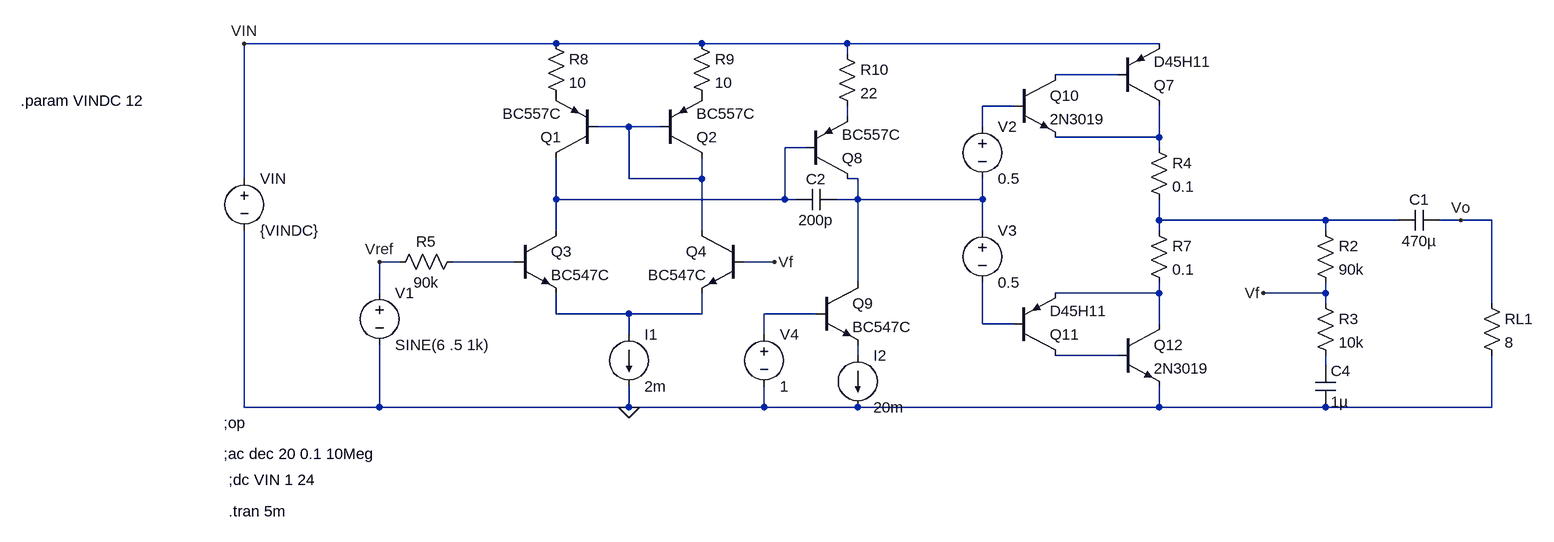
[diagram p0: schematic RegLin_v5_to_Amp_5.asc]
RegLin_v5_to_Amp_5.asc, the LTspice schematic file:
Version 4
SHEET 1 2168 1176
WIRE 96 -32 -384 -32
WIRE 320 -32 96 -32
WIRE 544 -32 320 -32
WIRE 1024 -32 544 -32
WIRE 544 -16 544 -32
WIRE 960 16 864 16
WIRE 800 64 752 64
WIRE 544 80 544 64
WIRE 208 96 160 96
WIRE 256 96 208 96
WIRE 752 96 752 64
WIRE 1024 112 1024 64
WIRE 1024 112 864 112
WIRE 480 128 448 128
WIRE 1024 128 1024 112
WIRE -384 176 -384 -32
WIRE 208 176 208 96
WIRE 320 176 320 144
WIRE 320 176 208 176
WIRE 560 176 544 176
WIRE 96 208 96 144
WIRE 448 208 448 128
WIRE 448 208 96 208
WIRE 464 208 448 208
WIRE 560 208 560 176
WIRE 560 208 528 208
WIRE 752 208 752 176
WIRE 752 208 560 208
WIRE 1024 240 1024 208
WIRE 1280 240 1024 240
WIRE 1392 240 1280 240
WIRE 1488 240 1456 240
WIRE 1536 240 1488 240
WIRE 96 256 96 208
WIRE 320 256 320 176
WIRE 752 256 752 208
WIRE 1024 256 1024 240
WIRE 1280 256 1280 240
WIRE -144 304 -176 304
WIRE 32 304 -64 304
WIRE 432 304 384 304
WIRE 560 336 560 208
WIRE -176 352 -176 304
WIRE 1024 352 1024 336
WIRE 1024 352 864 352
WIRE 1280 352 1280 336
WIRE 1280 352 1184 352
WIRE 1280 368 1280 352
WIRE 1536 368 1536 240
WIRE 96 384 96 352
WIRE 208 384 96 384
WIRE 320 384 320 352
WIRE 320 384 208 384
WIRE 496 384 416 384
WIRE 752 400 752 336
WIRE 800 400 752 400
WIRE 1024 400 1024 352
WIRE 208 416 208 384
WIRE 416 416 416 384
WIRE 560 448 560 432
WIRE 960 448 864 448
WIRE 1280 464 1280 448
WIRE -384 528 -384 256
WIRE -176 528 -176 432
WIRE -176 528 -384 528
WIRE 208 528 208 496
WIRE 208 528 -176 528
WIRE 416 528 416 496
WIRE 416 528 208 528
WIRE 560 528 416 528
WIRE 1024 528 1024 496
WIRE 1024 528 560 528
WIRE 1280 528 1024 528
WIRE 1536 528 1536 448
WIRE 1536 528 1280 528
FLAG 208 528 0
FLAG -176 304 Vref
FLAG -384 -32 VIN
FLAG 1488 240 Vo
FLAG 1184 352 Vf
FLAG 432 304 Vf
DATAFLAG 1184 240 ""
DATAFLAG 1232 352 ""
SYMBOL pnp 160 144 R180
SYMATTR InstName Q1
SYMATTR Value BC557C
SYMBOL pnp 256 144 M180
SYMATTR InstName Q2
SYMATTR Value BC557C
SYMBOL npn 32 256 R0
SYMATTR InstName Q3
SYMATTR Value BC547C
SYMBOL npn 384 256 M0
SYMATTR InstName Q4
SYMATTR Value BC547C
SYMBOL voltage -384 160 R0
WINDOW 123 24 124 Left 2
WINDOW 39 0 0 Left 0
SYMATTR InstName VIN
SYMATTR Value {VINDC}
SYMBOL res 80 -48 R0
SYMATTR InstName R8
SYMATTR Value 10
SYMBOL res 304 -48 R0
SYMATTR InstName R9
SYMATTR Value 10
SYMBOL pnp 480 176 M180
SYMATTR InstName Q8
SYMATTR Value BC557C
SYMBOL res 528 -32 R0
SYMATTR InstName R10
SYMATTR Value 22
SYMBOL cap 528 192 R90
WINDOW 0 0 32 VBottom 2
WINDOW 3 32 32 VTop 2
SYMATTR InstName C2
SYMATTR Value 200p
SYMATTR SpiceLine Rser=1k
SYMBOL npn 496 336 R0
SYMATTR InstName Q9
SYMATTR Value BC547C
SYMBOL pnp 960 64 M180
SYMATTR InstName Q7
SYMATTR Value D45H11
SYMBOL npn 800 16 R0
SYMATTR InstName Q10
SYMATTR Value 2N3019
SYMBOL res 1264 240 R0
SYMATTR InstName R2
SYMATTR Value 90k
SYMBOL res 1264 352 R0
SYMATTR InstName R3
SYMATTR Value 10k
SYMBOL res 1520 352 R0
SYMATTR InstName RL1
SYMATTR Value 8
SYMBOL cap 1456 224 R90
WINDOW 0 0 32 VBottom 2
WINDOW 3 32 32 VTop 2
SYMATTR InstName C1
SYMATTR Value 470µ
SYMBOL pnp 800 448 M180
SYMATTR InstName Q11
SYMATTR Value D45H11
SYMBOL npn 960 400 R0
SYMATTR InstName Q12
SYMATTR Value 2N3019
SYMBOL res 1008 112 R0
SYMATTR InstName R4
SYMATTR Value 0.1
SYMBOL res 1008 240 R0
SYMATTR InstName R7
SYMATTR Value 0.1
SYMBOL cap 1264 464 R0
SYMATTR InstName C4
SYMATTR Value 1µ
SYMBOL voltage 752 80 R0
WINDOW 123 0 0 Left 0
WINDOW 39 0 0 Left 0
SYMATTR InstName V2
SYMATTR Value 0.5
SYMBOL voltage 752 240 R0
WINDOW 123 0 0 Left 0
WINDOW 39 0 0 Left 0
SYMATTR InstName V3
SYMATTR Value 0.5
SYMBOL voltage -176 336 R0
WINDOW 123 24 124 Left 2
WINDOW 39 0 0 Left 0
SYMATTR InstName V1
SYMATTR Value SINE(6 .5 1k)
SYMBOL res -48 288 R90
WINDOW 0 0 56 VBottom 2
WINDOW 3 32 56 VTop 2
SYMATTR InstName R5
SYMATTR Value 90k
SYMBOL current 208 416 R0
WINDOW 123 0 0 Left 0
WINDOW 39 0 0 Left 0
SYMATTR InstName I1
SYMATTR Value 2m
SYMBOL current 560 448 R0
WINDOW 123 0 0 Left 0
WINDOW 39 0 0 Left 0
SYMATTR InstName I2
SYMATTR Value 20m
SYMBOL voltage 416 400 R0
WINDOW 123 0 0 Left 0
WINDOW 39 0 0 Left 0
SYMATTR InstName V4
SYMATTR Value 1
TEXT -416 552 Left 2 !;op
TEXT -416 600 Left 2 !;ac dec 20 0.1 10Meg
TEXT -408 640 Left 2 !;dc VIN 1 24
TEXT -728 56 Left 2 !.param VINDC 12
TEXT -408 688 Left 2 !.tran 5m

The netlist it stands for:
* RegLin_v5_to_Amp_5.asc
Q1 N006 N004 P001 0 BC557C
Q2 N004 N004 P002 0 BC557C
Q3 N006 N009 N011 0 BC547C
Q4 N004 Vf N011 0 BC547C
VIN VIN 0 {VINDC}
R8 VIN P001 10
R9 VIN P002 10
Q8 N007 N006 N003 0 BC557C
R10 VIN N003 22
C2 N007 N006 200p Rser=1k
Q9 N007 N012 N014 0 BC547C
Q7 N005 N001 VIN 0 D45H11
Q10 N001 N002 N005 0 2N3019
R2 N008 Vf 90k
R3 Vf N016 10k
RL1 Vo 0 8
C1 Vo N008 470µ
Q11 N015 N013 N010 0 D45H11
Q12 N010 N015 0 0 2N3019
R4 N005 N008 0.1
R7 N008 N010 0.1
C4 N016 0 1µ
V2 N002 N007 0.5
V3 N007 N013 0.5
V1 Vref 0 SINE(6 .5 1k)
R5 N009 Vref 90k
I1 N011 0 2m
I2 N014 0 20m
V4 N012 0 1
.model NPN NPN
.model PNP PNP
.lib standard.bjt
;op
;ac dec 20 0.1 10Meg
;dc VIN 1 24
.param VINDC 12
.tran 5m
.backanno
.end